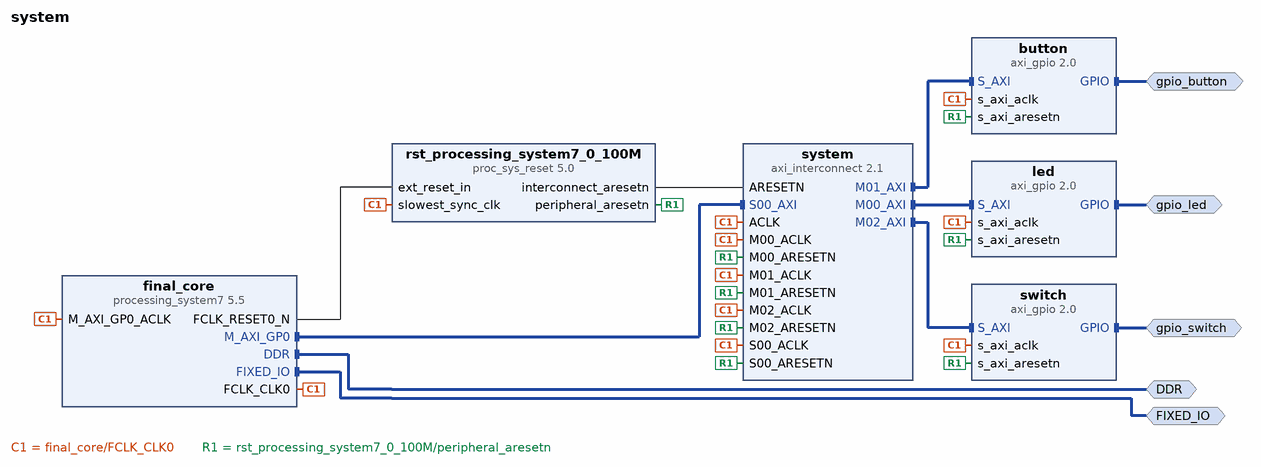
[diagram p0: block diagram of the top level]
# Vivado block design system, Vivado 2014.4
create_bd_design system

create_bd_intf_port -mode Master -vlnv xilinx.com:interface:ddrx_rtl:1.0 DDR
create_bd_intf_port -mode Master -vlnv xilinx.com:display_processing_system7:fixedio_rtl:1.0 FIXED_IO
create_bd_intf_port -mode Master -vlnv xilinx.com:interface:gpio_rtl:1.0 gpio_button
create_bd_intf_port -mode Master -vlnv xilinx.com:interface:gpio_rtl:1.0 gpio_led
create_bd_intf_port -mode Master -vlnv xilinx.com:interface:gpio_rtl:1.0 gpio_switch

create_bd_cell -type ip -vlnv xilinx.com:ip:axi_gpio:2.0 led
set_property -dict [list \
  CONFIG.C_GPIO_WIDTH 3 \
  CONFIG.C_ALL_INPUTS 0 \
  CONFIG.C_DOUT_DEFAULT 0x00000000 \
  CONFIG.C_ALL_OUTPUTS 1 \
] [get_bd_cells led]
create_bd_cell -type ip -vlnv xilinx.com:ip:axi_gpio:2.0 button
set_property -dict {CONFIG.C_GPIO_WIDTH 4 CONFIG.C_ALL_INPUTS 1} [get_bd_cells button]
create_bd_cell -type ip -vlnv xilinx.com:ip:processing_system7:5.5 final_core
set_property -dict [list \
  CONFIG.PCW_IMPORT_BOARD_PRESET C:/xup/embedded/sources/ps7_system_prj.xml \
  CONFIG.PCW_QSPI_PERIPHERAL_ENABLE 0 \
  CONFIG.PCW_ENET0_PERIPHERAL_ENABLE 0 \
  CONFIG.PCW_SD0_PERIPHERAL_ENABLE 0 \
  CONFIG.PCW_USB0_PERIPHERAL_ENABLE 0 \
] [get_bd_cells final_core]
# 4 more settings of final_core are not shown: defaults, MIO pin electricals, DDR timing, and values the tool derives
create_bd_cell -type ip -vlnv xilinx.com:ip:axi_interconnect:2.1 system
set_property -dict {CONFIG.NUM_MI 3} [get_bd_cells system]
create_bd_cell -type ip -vlnv xilinx.com:ip:proc_sys_reset:5.0 rst_processing_system7_0_100M
create_bd_cell -type ip -vlnv xilinx.com:ip:axi_gpio:2.0 switch
set_property -dict {CONFIG.C_GPIO_WIDTH 1 CONFIG.C_ALL_INPUTS 1} [get_bd_cells switch]

# ---- connections ----

connect_bd_intf_net -intf_net processing_system7_0_M_AXI_GP0 [get_bd_intf_pins final_core/M_AXI_GP0] [get_bd_intf_pins system/S00_AXI]
connect_bd_intf_net [get_bd_intf_pins system/M00_AXI] [get_bd_intf_pins led/S_AXI]
connect_bd_intf_net [get_bd_intf_pins button/S_AXI] [get_bd_intf_pins system/M01_AXI]
connect_bd_intf_net [get_bd_intf_pins system/M02_AXI] [get_bd_intf_pins switch/S_AXI]
connect_bd_intf_net -intf_net processing_system7_0_DDR [get_bd_intf_ports DDR] [get_bd_intf_pins final_core/DDR]
connect_bd_intf_net -intf_net processing_system7_0_FIXED_IO [get_bd_intf_ports FIXED_IO] [get_bd_intf_pins final_core/FIXED_IO]
connect_bd_intf_net [get_bd_intf_ports gpio_button] [get_bd_intf_pins button/GPIO]
connect_bd_intf_net [get_bd_intf_ports gpio_led] [get_bd_intf_pins led/GPIO]
connect_bd_intf_net [get_bd_intf_ports gpio_switch] [get_bd_intf_pins switch/GPIO]
connect_bd_net -net processing_system7_0_FCLK_CLK0 [get_bd_pins final_core/FCLK_CLK0] \
  [get_bd_pins led/s_axi_aclk] [get_bd_pins button/s_axi_aclk] [get_bd_pins final_core/M_AXI_GP0_ACLK] \
  [get_bd_pins rst_processing_system7_0_100M/slowest_sync_clk] [get_bd_pins switch/s_axi_aclk] [get_bd_pins system/ACLK] \
  [get_bd_pins system/S00_ACLK] [get_bd_pins system/M00_ACLK] [get_bd_pins system/M01_ACLK] [get_bd_pins system/M02_ACLK]
connect_bd_net -net processing_system7_0_FCLK_RESET0_N [get_bd_pins final_core/FCLK_RESET0_N] [get_bd_pins rst_processing_system7_0_100M/ext_reset_in]
connect_bd_net [get_bd_pins rst_processing_system7_0_100M/peripheral_aresetn] \
  [get_bd_pins led/s_axi_aresetn] [get_bd_pins button/s_axi_aresetn] [get_bd_pins switch/s_axi_aresetn] \
  [get_bd_pins system/S00_ARESETN] [get_bd_pins system/M00_ARESETN] [get_bd_pins system/M01_ARESETN] \
  [get_bd_pins system/M02_ARESETN]
connect_bd_net [get_bd_pins rst_processing_system7_0_100M/interconnect_aresetn] [get_bd_pins system/ARESETN]

# ---- address map ----
assign_bd_address -offset 0x41200000 -range 64K -target_address_space [get_bd_addr_spaces final_core/Data] [get_bd_addr_segs led/S_AXI/Reg]
assign_bd_address -offset 0x41210000 -range 64K -target_address_space [get_bd_addr_spaces final_core/Data] [get_bd_addr_segs button/S_AXI/Reg]
assign_bd_address -offset 0x41220000 -range 64K -target_address_space [get_bd_addr_spaces final_core/Data] [get_bd_addr_segs switch/S_AXI/Reg]

validate_bd_design
save_bd_design
